# Altium schematic sheet Sber_Stroboscope_v1_01_001.SchDoc
size 594 x 420 mm; Date: 08.02.2024; CheckedBy: Васильев Д.С.; Author: Васильев Д.С.; CompanyName: SBER; DrawnBy: Васильев Д.С.; SheetNumber: 1; SheetTotal: 2
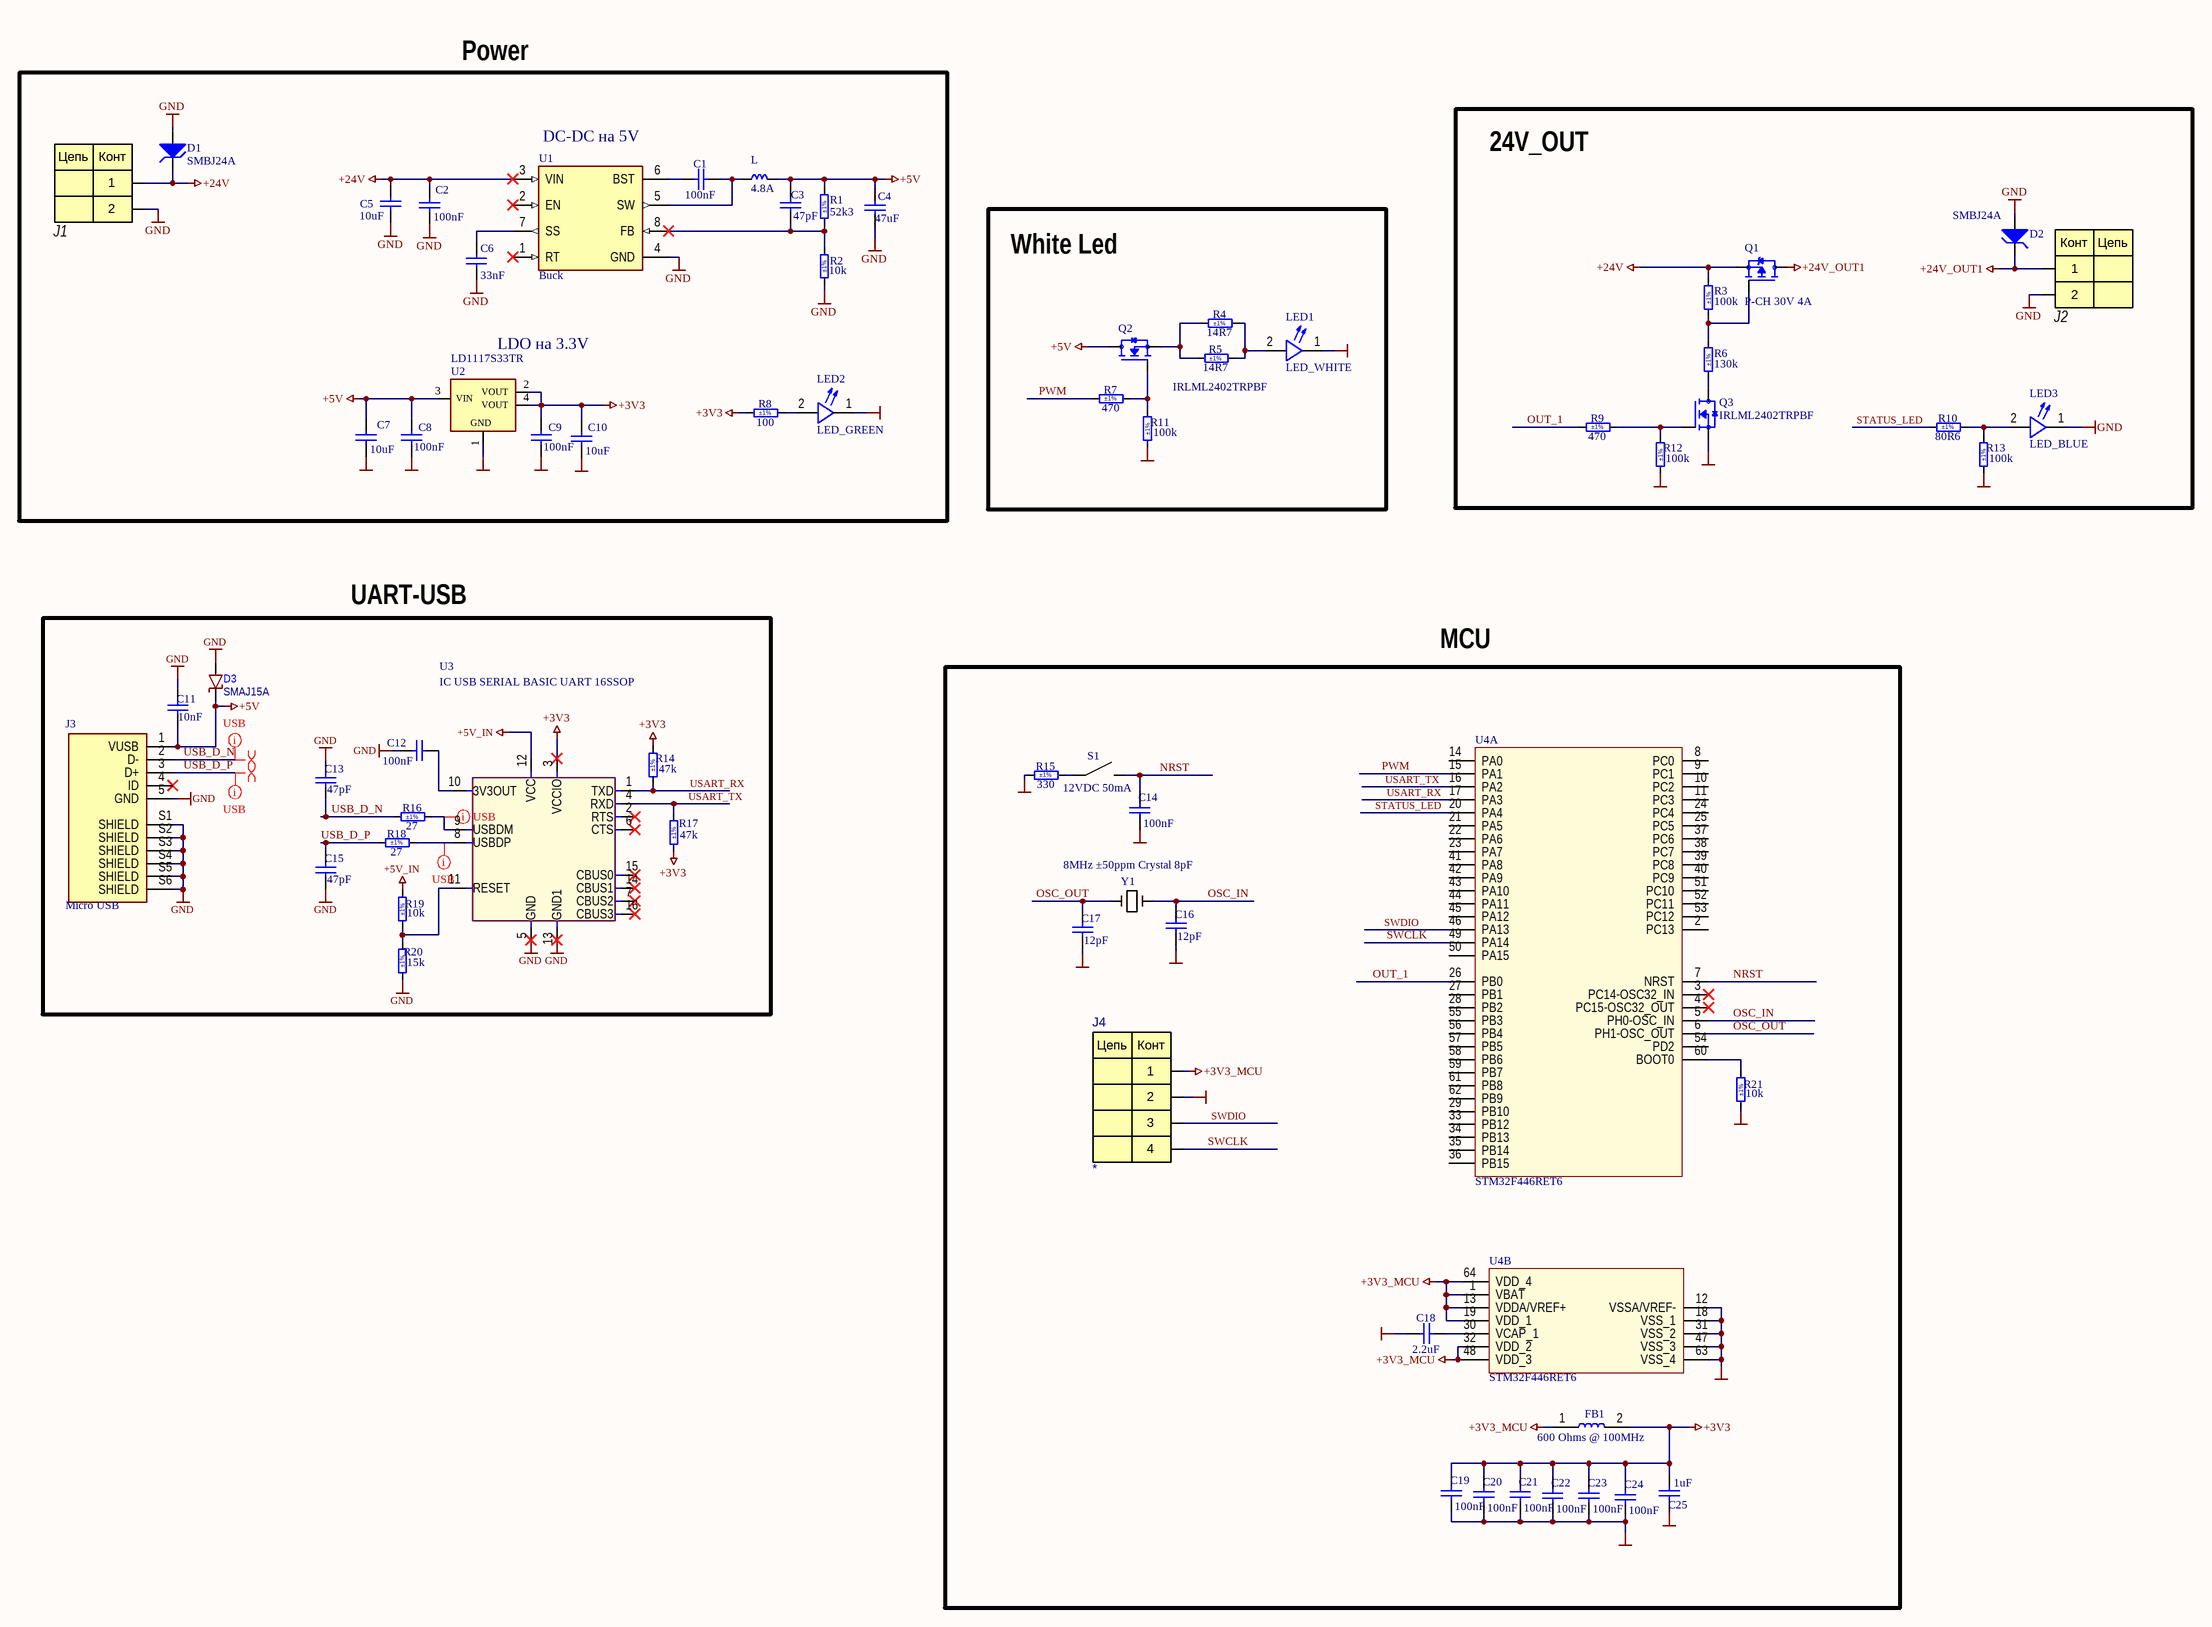
[diagram p0: Sber_Stroboscope_v1_01_001.SchDoc]

## Parts
C1  100nF  [CAPC1608X87N]
C2  100nF  [CAPC1608X87N]
C3  47pF  [CAPC1608X87N]
C4  47uF  [CAPC2012X145N]
C5  10uF  [CAPC2012X145N]
C6  33nF  [CAPC1608X87N]
C7  10uF  [CAPC2012X95N]
C8  100nF  [CAPC1608X87N]
C9  100nF  [CAPC1608X87N]
C10  10uF  [CAPC2012X95N]
C11  10nF  [CAPC1608X87N]
C12  100nF  [CAPC1608X87N]
C13  47pF  [CAPC1608X87N]
C14  100nF  [CAPC1608X87N]
C15  47pF  [CAPC1608X87N]
C16  12pF  [CAPC1608X87N]
C17  12pF  [CAPC1608X87N]
C18  2.2uF  [CAPC1608X87N]
C19  100nF  [CAPC1608X87N]
C20  100nF  [CAPC1608X87N]
C21  100nF  [CAPC1608X87N]
C22  100nF  [CAPC1608X87N]
C23  100nF  [CAPC1608X87N]
C24  100nF  [CAPC1608X87N]
C25  1uF  [CAPC1608X87N]
D1  SMBJ24A  [SMBJ24A]
D2  SMBJ24A  [SMBJ24A]
D3  SMAJ15A  [SZESD7371HT1G]
FB1  600 Ohms @ 100MHz  [Ferite Bead 0603]
J1  (no value)  [B2B-XH-A]
J2  (no value)  [B2B-XH-A]
J3  Micro USB  [Micro USB 10118192-0001LF - duplicate]
J4  *  [PLD-4_]
L  4.8A  [CLF10040T-6R8N-D]
LED1  LED_WHITE  [LTPL-A138DWAGB]
LED2  LED_GREEN  [LED_0805_GREEN]
LED3  LED_BLUE  [LED_0805_BLUE]
Q1  P-CH 30V 4A  [AO3401A]
Q2  IRLML2402TRPBF  [SOT23_3pins]
Q3  IRLML2402TRPBF  [SOT23_3pins]
R1  52k3  Tolerance: ±1%  [RESC1608X55N]
R2  10k  Tolerance: ±1%  [RESC1608X55N]
R3  100k  Tolerance: ±1%  [RESC1608X55N]
R4  14R7  Tolerance: ±1%  [RESC3016X65N]
R5  14R7  Tolerance: ±1%  [RESC3016X65N]
R6  130k  Tolerance: ±1%  [RESC1005X40N]
R7  470  Tolerance: ±1%  [RESC1608X55N]
R8  100  Tolerance: ±1%  [RESC1608X55N]
R9  470  Tolerance: ±1%  [RESC1608X55N]
R10  80R6  Tolerance: ±1%  [RESC1608X55N]
R11  100k  Tolerance: ±1%  [RESC1608X55N]
R12  100k  Tolerance: ±1%  [RESC1608X55N]
R13  100k  Tolerance: ±1%  [RESC1608X55N]
R14  47k  Tolerance: ±1%  [RESC1608X55N]
R15  330  Tolerance: ±1%  [RESC1608X55N]
R16  27  Tolerance: ±1%  [RESC1608X55N]
R17  47k  Tolerance: ±1%  [RESC1608X55N]
R18  27  Tolerance: ±1%  [RESC1608X55N]
R19  10k  Tolerance: ±1%  [RESC1608X55N]
R20  15k  Tolerance: ±1%  [RESC1608X55N]
R21  10k  Tolerance: ±1%  [RESC1608X55N]
S1  12VDC 50mA  [Pushbutton_2pins]
U1  Buck  [TPS62933DRLR]
U2  LD1117S33TR  [SOT-223_M]
U3  IC USB SERIAL BASIC UART 16SSOP  [FT230XS-R]
U4  STM32F446RET6  [STM32F446RET6]  (parts A,B of 2)
Y1  8MHz ±50ppm Crystal 8pF  [OSC_NX5032]

## Blocks framed on the sheet
24V_OUT: D2 J2 LED3 Q1 Q3 R3 R6 R9 R10 R12 R13
White Led: LED1 Q2 R4 R5 R7 R11

## Nets
+3V3: C9.1 C10.1 C19.1 C20.1 C21.1 C22.1 C23.1 C24.1 C25.2 FB1.2 R8.1 R14.1 R17.2 U2.2(VOUT) U2.4(VOUT) U3.3(VCCIO)
+3V3_MCU: FB1.1 J4.1 U4.1(VBAT) U4.13(VDDA/VREF+) U4.19(VDD_1) U4.32(VDD_2) U4.48(VDD_3) U4.64(VDD_4)
+5V: C3.1 C4.2 C7.1 C8.1 C11.1 D3.2(K) J3.1(VUSB) L.2 Q2.3(D) R1.1 U2.3(VIN)
+5V_IN: R19.1 U3.12(VCC)
+24V: C2.1 C5.2 D1.1 J1.1 Q1.2(S) R3.1 U1.3(VIN)
+24V_OUT1: D2.1 J2.1 Q1.3(D)
GND: C2.2 C4.1 C5.1 C6.2 C7.2 C8.2 C9.2 C10.2 C11.2 C12.2 C13.2 C14.2 C15.1 C16.2 C17.2 C18.1 C19.2 C20.2 C21.2 C22.2 C23.2 C24.2 C25.1 D1.2 D2.2 D3.1(A) J1.2 J2.2 J3.5(GND) J3.S1(SHIELD) J3.S2(SHIELD) J3.S3(SHIELD) J3.S4(SHIELD) J3.S5(SHIELD) J3.S6(SHIELD) J4.2 LED1.1 LED2.1 LED3.1 Q3.2(S) R2.2 R11.2 R12.2 R13.2 R15.1 R20.2 R21.2 U1.4(GND) U2.1(GND) U3.5(GND) U3.13(GND1) U4.12(VSSA/VREF-) U4.18(VSS_1) U4.31(VSS_2) U4.47(VSS_3) U4.63(VSS_4)
NRST: C14.1 S1.2 U4.7(NRST)
OSC_IN: C16.1 U4.5(PH0-OSC_IN) Y1.1
OSC_OUT: C17.1 U4.6(PH1-OSC_OUT) Y1.2
OUT_1: R9.1 U4.26(PB0)
PWM: R7.1 U4.15(PA1)
STATUS_LED: R10.1 U4.20(PA4)
SWCLK: J4.4 U4.49(PA14)
SWDIO: J4.3 U4.46(PA13)
USART_RX: R14.2 U3.1(TXD) U4.17(PA3)
USART_TX: R17.1 U3.4(RXD) U4.16(PA2)
USB_D_N: C13.1 J3.2(D-) R16.1
USB_D_P: C15.2 J3.3(D+) R18.1
NetC1_1: C1.1 U1.6(BST)
NetC1_2: C1.2 L.1 U1.5(SW)
NetC3_2: C3.2 R1.2 R2.1 U1.8(FB)
NetC6_1: C6.1 U1.7(SS)
NetC12_1: C12.1 U3.10(3V3OUT)
NetC18_2: C18.2 U4.30(VCAP_1)
NetLED1_2: LED1.2(VCC) R4.2 R5.2
NetLED2_2: LED2.2(VCC) R8.2
NetLED3_2: LED3.2(VCC) R10.2 R13.1
NetQ1_1: Q1.1(G) R3.2 R6.1
NetQ2_1: Q2.1(G) R7.2 R11.1
NetQ2_2: Q2.2(S) R4.1 R5.1
NetQ3_1: Q3.1(G) R9.2 R12.1
NetQ3_3: Q3.3(D) R6.2
NetR15_2: R15.2 S1.1
NetR16_2: R16.2 U3.9(USBDM)
NetR18_2: R18.2 U3.8(USBDP)
NetR19_2: R19.2 R20.1 U3.11(RESET)
NetR21_1: R21.1 U4.60(BOOT0)

Not connected (* = marked no-connect by the designer): J3 4(ID)*; U1 1(RT)* 2(EN)*; U3 2(RTS)* 6(CTS)* 7(CBUS2)* 14(CBUS1)* 15(CBUS0)* 16(CBUS3)*; U4 2(PC13) 3(PC14-OSC32_IN)* 4(PC15-OSC32_OUT)* 8(PC0) 9(PC1) 10(PC2) 11(PC3) 14(PA0) 21(PA5) 22(PA6) 23(PA7) 24(PC4) 25(PC5) 27(PB1) 28(PB2) 29(PB10) 33(PB12) 34(PB13) 35(PB14) 36(PB15) 37(PC6) 38(PC7) 39(PC8) 40(PC9) 41(PA8) 42(PA9) 43(PA10) 44(PA11) 45(PA12) 50(PA15) 51(PC10) 52(PC11) 53(PC12) 54(PD2) 55(PB3) 56(PB4) 57(PB5) 58(PB6) 59(PB7) 61(PB8) 62(PB9)

## Layout directives
differential pair; differential pair class USB: USB_D_N, USB_D_P
net class USB: NetR16_2, NetR18_2, USB_D_N, USB_D_P

## Notes on the sheet
- Power
- (near U1) DC-DC на 5V
- (near U2) LDO на 3.3V
- UART-USB
- MCU
- Перв. примен.
- Справ. №
- Подп. и дата
- Инв. № дубл.
- Взам. инв. №
- Разраб.
- Изм.
- Лист
- № докум.
- Подп.
- Дата
- Лит.
- Масса
- Масштаб
- Пров.
- Т.контр.
- Листов
- Инв. № подл.
- Утв.
- Н.контр.
- Копировал
- Формат А2
- (in symbol JST_CONN_Header_VERT_2.5mm) Цепь; Конт
- (in symbol PLD-4) Цепь; Конт

## Library data of the parts
C1 C12 C14 C19-C24 = CC0603_100NF_50V_10%_X7R: Non-polarised capacitor; Part Description: SMD Multilayer Chip Ceramic Capacitor; Manufacturer: GENERIC; Manufacturer1 Part Number: 223858615649; Voltage: 50V; TC: X7R; Tolerance: ±10%; Part Number: CC0603_100NF_50V_10%_X7R; Component Kind: Standard; Component Type: Standard; Pin Count: 2; Value: 100nF; Status: Preferred; Manufacturer Part Number: CC0603_100NF_50V_10%_X7R; Case: 0603; Mounted: Yes; Socket: No; SMD: Yes; Sense: No; Manufacturer1 Example: PHYCOMP; Manufacturer1 ComponentHeight: 0.87mm; HelpURL: \\cern.ch\dfs\Applications\Altium\Datasheets\CC0603_X7R_PHYCOMP.pdf; Author: CERN DEM JLC; CreateDate: 03.12.2007; LatestRevisionDate: 03.12.2007
C2 C8 C9 = CC0603_100NF_50V_10%_X5R: Non-polarised capacitor; Part Description: SMD Multilayer Chip Ceramic Capacitor; Manufacturer: GENERIC; Manufacturer1 Part Number: C1608X5R1H104K080; Voltage: 50V; TC: X5R; Tolerance: ±10%; Part Number: CC0603_100NF_50V_10%_X5R; Component Kind: Standard; Component Type: Standard; Pin Count: 2; Value: 100nF; Status: None; Manufacturer Part Number: CC0603_100NF_50V_10%_X5R; Case: 0603; Mounted: Yes; Socket: No; SMD: Yes; Sense: No; Manufacturer1 Example: TDK; Manufacturer1 ComponentHeight: 0.9mm; HelpURL: \\cern.ch\dfs\Applications\Altium\Datasheets\CC0603_X5R_TDK_C.pdf; Author: CERN DEM MR; CreateDate: 08.01.2016; LatestRevisionDate: 08.01.2016
C3 C13 C15 = CC0603_47PF_50V_5%_NP0: Non-polarised capacitor; Part Description: SMD Multilayer Chip Ceramic Capacitor; Manufacturer: GENERIC; Manufacturer1 Part Number: 223886715479; Voltage: 50V; TC: C0G/NP0; Tolerance: ±5%; Part Number: CC0603_47PF_50V_5%_NP0; Component Kind: Standard; Component Type: Standard; Pin Count: 2; Value: 47pF; Status: Preferred; Manufacturer Part Number: CC0603_47PF_50V_5%_NP0; Case: 0603; Mounted: Yes; Socket: No; SMD: Yes; Sense: No; Manufacturer1 Example: PHYCOMP; Manufacturer1 ComponentHeight: 0.87mm; HelpURL: \\cern.ch\dfs\Applications\Altium\Datasheets\CC0603_NP0_PHYCOMP.pdf; Author: CERN DEM JLC; CreateDate: 03.12.2007; LatestRevisionDate: 03.12.2007
C4 = CC0805_47UF_10V_20%_X5R: Non-polarised capacitor; Part Description: SMD Multilayer Chip Ceramic Capacitor; Manufacturer: GENERIC; Manufacturer1 Part Number: GRM21BR61A476ME15; Voltage: 10V; TC: X5R; Tolerance: ±20%; Part Number: CC0805_47UF_10V_20%_X5R; Component Kind: Standard; Component Type: Standard; Pin Count: 2; Value: 47uF; Status: Preferred; Manufacturer Part Number: CC0805_47UF_10V_20%_X5R; Case: 0805; Mounted: Yes; Socket: No; SMD: Yes; Sense: No; Manufacturer1 Example: MURATA; Manufacturer1 ComponentHeight: 1.45mm; HelpURL: \\cern.ch\dfs\Applications\Altium\Datasheets\CC0805_MURATA_GRM21BR61A476ME15.pdf; Author: CERN DEM BC; CreateDate: 08.09.2020; LatestRevisionDate: 08.09.2020
C5 = CC0805_10UF_35V_10%_X5R_MURATA_GRM21BR6YA106KE43L: Non-polarised capacitor; Part Description: Chip Multilayer Ceramic Capacitor for General Purpose; Manufacturer: MURATA; Voltage: 35V; TC: X5R; Tolerance: ±10%; Part Number: CC0805_10UF_35V_10%_X5R_MURATA_GRM21BR6YA106KE43L; Component Kind: Standard; Component Type: Standard; Pin Count: 2; Value: 10uF; Status: Not Recommended; Manufacturer Part Number: GRM21BR6YA106KE43; Case: 0805; Mounted: Yes; Socket: No; SMD: Yes; Sense: No; ComponentHeight: 1.45mm; HelpURL: \\cern.ch\dfs\Applications\Altium\Datasheets\CC0805_MURATA_GRM21BR6YA106KE43L.pdf; Author: CERN DEM BC; CreateDate: 24.03.2020; LatestRevisionDate: 24.03.2020
C6 = CC0603_33NF_25V_10%_X7R: Non-polarised capacitor; Part Description: SMD Multilayer Chip Ceramic Capacitor; Manufacturer: GENERIC; Manufacturer1 Part Number: 223891615643; Voltage: 25V; TC: X7R; Tolerance: ±10%; Part Number: CC0603_33NF_25V_10%_X7R; Component Kind: Standard; Component Type: Standard; Pin Count: 2; Value: 33nF; Status: Preferred; Manufacturer Part Number: CC0603_33NF_25V_10%_X7R; Case: 0603; Mounted: Yes; Socket: No; SMD: Yes; Sense: No; Manufacturer1 Example: PHYCOMP; Manufacturer1 ComponentHeight: 0.87mm; HelpURL: \\cern.ch\dfs\Applications\Altium\Datasheets\CC0603_X7R_PHYCOMP.pdf; Author: CERN DEM JLC; CreateDate: 03.12.2007; LatestRevisionDate: 03.12.2007
C7 C10 = CC0805_10UF_25V_10%_X5R: Non-polarised capacitor; Part Description: SMD Multilayer Chip Ceramic Capacitor; Manufacturer: GENERIC; Manufacturer1 Part Number: GRM219R61E106KA12D; Voltage: 25V; TC: X5R; Tolerance: ±10%; Part Number: CC0805_10UF_25V_10%_X5R; Component Kind: Standard; Component Type: Standard; Pin Count: 2; Value: 10uF; Status: Preferred; Manufacturer Part Number: CC0805_10UF_25V_10%_X5R; Case: 0805; Mounted: Yes; Socket: No; SMD: Yes; Sense: No; Manufacturer1 Example: MURATA; Manufacturer1 ComponentHeight: 0.95mm; HelpURL: \\cern.ch\dfs\Applications\Altium\Datasheets\CC0805_X5R_MURATA_GRM.pdf; Author: CERN DEM JLC; CreateDate: 25.10.2012; LatestRevisionDate: 06.09.2016
C11 = CC0603_10NF_50V_5%_C0G: Non-polarised capacitor; Part Description: SMD Multilayer Chip Ceramic Capacitor; Manufacturer: GENERIC; Manufacturer1 Part Number: C1608C0G1H103J080; Voltage: 50V; TC: C0G/NP0; Tolerance: ±5%; Part Number: CC0603_10NF_50V_5%_C0G; Component Kind: Standard; Component Type: Standard; Pin Count: 2; Value: 10nF; Status: Preferred; Manufacturer Part Number: CC0603_10NF_50V_5%_C0G; Case: 0603; Mounted: Yes; Socket: No; SMD: Yes; Sense: No; Manufacturer1 Example: TDK; Manufacturer1 ComponentHeight: 0.9mm; HelpURL: \\cern.ch\dfs\Applications\Altium\Datasheets\CC0603_C0G_TDK_C.pdf; Author: CERN DEM JLC; CreateDate: 10.12.2014; LatestRevisionDate: 10.12.2014
C16 C17 = CC0603_12PF_50V_5%_NP0: Non-polarised capacitor; Part Description: SMD Multilayer Chip Ceramic Capacitor; Manufacturer: GENERIC; Manufacturer1 Part Number: 223886715129; Voltage: 50V; TC: C0G/NP0; Tolerance: ±5%; Part Number: CC0603_12PF_50V_5%_NP0; Component Kind: Standard; Component Type: Standard; Pin Count: 2; Value: 12pF; Status: Preferred; Manufacturer Part Number: CC0603_12PF_50V_5%_NP0; Case: 0603; Mounted: Yes; Socket: No; SMD: Yes; Sense: No; Manufacturer1 Example: PHYCOMP; Manufacturer1 ComponentHeight: 0.87mm; HelpURL: \\cern.ch\dfs\Applications\Altium\Datasheets\CC0603_NP0_PHYCOMP.pdf; Author: CERN DEM JLC; CreateDate: 03.12.2007; LatestRevisionDate: 03.12.2007
C18 = CC0603_2.2UF_16V_10%_X5R: Non-polarised capacitor; Part Description: SMD Multilayer Chip Ceramic Capacitor; Manufacturer: GENERIC; Manufacturer1 Part Number: CC0603KRX5R7BB225; Voltage: 16V; TC: X5R; Tolerance: ±10%; Part Number: CC0603_2.2UF_16V_10%_X5R; Component Kind: Standard; Component Type: Standard; Pin Count: 2; Value: 2.2uF; Status: Preferred; Manufacturer Part Number: CC0603_2.2UF_16V_10%_X5R; Case: 0603; Mounted: Yes; Socket: No; SMD: Yes; Sense: No; Manufacturer1 Example: YAGEO PHYCOMP; Manufacturer1 ComponentHeight: 0.9mm; HelpURL: \\cern.ch\dfs\Applications\Altium\Datasheets\CC0805_X5R_PHYCOMP_HC.pdf; Author: CERN DEM JLC; CreateDate: 28.04.2011; LatestRevisionDate: 28.04.2011
C25 = CC0603_1UF_50V_10%_X5R: Non-polarised capacitor; Part Description: SMD Multilayer Chip Ceramic Capacitor; Manufacturer: GENERIC; Manufacturer1 Part Number: C1608X5R1H105K080; Voltage: 50V; TC: X5R; Tolerance: ±10%; Part Number: CC0603_1UF_50V_10%_X5R; Component Kind: Standard; Component Type: Standard; Pin Count: 2; Value: 1uF; Status: None; Manufacturer Part Number: CC0603_1UF_50V_10%_X5R; Case: 0603; Mounted: Yes; Socket: No; SMD: Yes; Sense: No; Manufacturer1 Example: TDK; Manufacturer1 ComponentHeight: 0.9mm; HelpURL: \\cern.ch\dfs\Applications\Altium\Datasheets\CC0603_X5R_TDK_C.pdf; Author: CERN DEM JMW; CreateDate: 09.11.2015; LatestRevisionDate: 09.11.2015
D1 D2 = DIODE_TVS_24V_SMBJ24A: ESD Suppressors / TVS Diodes 24volts 5uA 15.4 Amps Uni-Dir; Manufacturer: Bourns Inc.; Polarity: Unidirectional; Number of Channels:: 1 Channel; Working Voltage:: 24 V; Clamping Voltage:: 38.9 V; Breakdown Voltage:: 26.7 V; Ipp - Peak Pulse Current: 15.5 A; Pppm - Peak Pulse Power Dissipation:: 600 W; Series:: SMBJ; ComponentLink2Description: Datasheet; ComponentLink3Description: Package Specification; Part Number: SMBJ24A; Termination Style:: SMD/SMT; Package: DO-214AA-2; Product Type: TVS Diodes; Minimum Operating Temperature:: - 55 C; Maximum Operating Temperature:: + 150 C
D3 = DIODE_TVS_7V_SZESD7371HT1G: TVS DIODE 5.3VWM SOD323; Manufacturer: onsemi; Type: Zener; Unidirectional Channels: 1; Voltage - Reverse Standoff (Typ): 5.3V (Max); Voltage - Breakdown (Min): 7V; Current - Peak Pulse (10/1000µs): 16.4A; Power Line Protection: No; Capacitance @ Frequency: 0.43pF @ 1MHz; Part Number: SZESD7371HT1G; Voltage - Clamping (Max) @ Ipp: -; Power - Peak Pulse: -; Applications: Automotive, RF Antenna; Operating Temperature: -55°C ~ 150°C (TJ); Mounting Type: Surface Mount; Package: SOD-323
FB1 = MPZ1608S601ATA00: 600 Ohms @ 100MHz 1 Power Line Ferrite Bead 0603 _1608 Metric_ 1A 150mOhm; Manufacturer: TDK Corporation; ComponentLink2Description: Elitan; ComponentLink2URL: https://www.elitan.ru/price/item600575; Part Number: MPZ1608S601ATA00; Filter Type: Power Line; Current Rating: 1A; DC Resistance: 150mOhm; Operating Temperature: -55°C ~ 125°C; Package: 0603; Mounting Type: Surface Mount; Impedance @ Frequency: 600 Ohms @ 100MHz
J1 J2 = JST_CONN_Header_VERT_2.5mm: CONN HEADER VERT 2POS 2.5MM; Manufacturer: JST Sales America Inc.; Current Rating: 3A; Number of Positions: 2; Pitch - Mating: 2.50mm; Shrouding: Shrouded-4 Wall; Voltage Rating: 250V; Part Number: B2B-XH-A; Connector Type: Header; Contact Material: Brass; Contact Type: Male Pin; Fastening Type: Detent Lock; Mounting Type: Through Hole; Number of Rows: 1; Operating Temperature: -25В C ~ 85В C; Series: XH
J3 = Micro USB 10118194-0001LF_1: CONN RCPT USB2.0 MICRO B SMD R/A; Manufacturer: Amphenol ICC (FCI); Connector Type: USB - micro B; Number of Contacts: 5; Gender: Receptacle; Number of Ports: 1; Current Rating (Amps): 1.8A per Contact; Voltage - Rated: 100VAC; Mating Cycles: 10000; Shielding: Shielded; Part Number: 10118194-0001LF; Specifications: USB 2.0; Mounting Type: Surface Mount, Right Angle; Through Hole; Mounting Feature: Flange, Horizontal; Termination: Solder; Features: Solder Retention; Ingress Protection: -; Operating Temperature: -30°C ~ 80°C; Contact Finish: Gold; Shell/Shielding Material: Steel, Stainless
J4 = PLD-4: Manufacturer: China; Check: False; Annotation: *; Param: *; Value: *; Part Number: PLD-4; Place: *; Temperature: -40°C~105°C
L = IND_6.8UH_20%_4.8A_TDK: Power Inductors - SMD 6.8uH 18.5mOhms 4.8A AEC-Q200 (150C); Manufacturer: TDK; Shielding: Shielded; Tolerance: 30 %; Maximum DC Current: 3.7 A; Core Type: Wirewound; Part Number: CLF10040T-6R8N-D; Termination Style: SMD/SMT; Package: 10 mm x 9.7 mm; Inductance: 6.8 uH; Maximum DC Resistance: 18.5 mOhms; Saturation Current: 4.8 A; Minimum Operating Temperature: - 40 C; Maximum Operating Temperature: + 105 C; Mounting Style: PCB Mount
LED1 = LED_0505_White: LED Lighting - White, Neutral 4500K (4000K ~ 5000K) 3.2V 1A 120° 0505 (1313 Metric); Manufacturer: Lite-On Inc.; Flux @ 25°C, Current - Test: 240lm (Typ); Lumens/Watt @ Current - Test: 75 lm/W; CRI (Color Rendering Index): 80; Current - Max: 350mA; Thermal Resistance of Package: 9.5°C/W; Part Number: LTPL-A138DWAGB; Colour: White, Neutral; CCT (K): 4500K (4000K ~ 5000K); Current - Test: 1A; Voltage - Forward (Vf) (Typ): 3.2V; Viewing Angle: 120°; Mounting Type: Surface Mount; Package: 0505
LED2 = LED_0805_GREEN_2: Green 525nm LED Indication - Discrete 3.2V 0805 (2012 Metric); Part Number: SZYY0805G; Manufacturer: otoelectric SZYY0805G; Wave Length: 518 nm; Peak Forard Current: 100mA; Power Dissipation: 120mW; Continious Forward Current: 20mA; Voltage Forward: 2.9; Colour: Green; Operating Temperature: -20C to +80C; Mounting Type: Surface Mount; Package: 0805; ComponentLink1Description: Chip-Dip; ComponentLink1URL: https://www.chipdip.ru/product/to-2013bc-pg
LED3 = LED_0805_BLUE_1: LED_0805_BLUE SMD 247mKd 468нМ; Part Number: SZYY0805B; Manufacturer: Yongyu Photoelectric; Colour: Blue; Wave Length: 468 nm; Peak Forard Current: 80mA; Power Dissipation: 105mW; Continious Forward Current: 30mA; Voltage Forward: 2.9; Operating Temperature: -55C to +85C; Mounting Type: Surface Mount; Package: 0805; ComponentLink1Description: Chip-Dip; ComponentLink1URL: https://www.chipdip.ru/product/to-2013bc-bf
Q1 = Q_AO3401A: MOSFET P-CH 30V 4A SOT23-3L; Manufacturer: Alpha & Omega Semiconductor Inc.; FET Type: P-Channel; Current - Continuous Drain (Id) @ 25°C: 4A (Ta); Drive Voltage (Max Rds On, Min Rds On): 10V; Rds On (Max) @ Id, Vgs: 44mOhm @ 4.3A, 10V; Vgs(th) (Max) @ Id: 1.3V @ 250µA; Gate Charge (Qg) (Max) @ Vgs: 12.2 nC @ 4.5 V; Vgs (Max): ±12V; Input Capacitance (Ciss) (Max) @ Vds: 1200 pF @ 15 V; Power Dissipation (Max): 1.4W (Ta); Part Number: AO3401A; Technology: MOSFET (Metal Oxide); Drain to Source Voltage (Vdss): 30 V; Operating Temperature: -55°C ~ 150°C (TJ); Mounting Type: Surface Mount; Package: SOT-23-3
Q2 Q3 = Q_IRLML2402TRPBF: N-Channel 20V 1.2A (Ta) 540mW (Ta) Surface Mount Micro3™/SOT-23; Manufacturer: Infineon Technologies; Type: MOSFET N-CH 20V 1.2A SOT23; Drive Voltage (Max Rds On, Min Rds On): 2.7V, 4.5V; Rds On (Max) @ Id, Vgs: 250mOhm @ 930mA, 4.5V; Vgs(th) (Max) @ Id: 700mV @ 250µA; Vgs (Max): ±12V; Input Capacitance: 110pF @ 15V; ComponentLink1Description: DigiKey; ComponentLink1URL: https://www.digikey.com/product-detail/en/infineon-technologies/IRLML2402TRPBF/IRLML2402PBFCT-ND/812508; ComponentLink2Description: Elitan; ComponentLink2URL: https://www.elitan.ru/price/index.php?find=IRLML2402TRPBF&delay=-1&mfg=all&seenform=y; Part Number: IRLML2402TRPBF; FET Type: N-Channel; Current - Continuous Drain (Id) @ 25°C: 1.2A (Ta); Power Dissipation (Max): 540mW (Ta); Operating Temperature: -55°C ~ 150°C (TJ); Mounting Type: Surface Mount; Package: SOT-23-3; Drain to Source Voltage (Vdss): 20V
R1 = R0603_52K3_0.1%_0.063W_10PPM: Resistor - 0.1%; Part Number: R0603_52K3_1%_0.063W_10PPM; Part Description: Thin Film Chip Resistor; Manufacturer: GENERIC; Manufacturer1 Part Number: RN73C1J52K3BTDF; Power: 0.063W; TC: ±10ppm; PressFit: No; Component Kind: Standard; Component Type: Standard; Pin Count: 2; Value: 52k3; Status: Not Recommended; Manufacturer Part Number: R0603_52K3_1%_0.063W_10PPM; Case: 0603; Mounted: Yes; Sense: No; Socket: No; SMD: Yes; Manufacturer1 Example: TYCO HOLSWORTHY; Manufacturer1 ComponentHeight: 0.5mm; HelpURL: \\cern.ch\dfs\Applications\Altium\Datasheets\R0603_Tyco_RN73.pdf; Author: CERN DEM JLC; CreateDate: 03.12.2007; LatestRevisionDate: 13.03.2008
R2 R19 R21 = R0603_10K_1%_0.1W_100PPM: Resistor - 1%; Part Description: General Purpose Thick Film Chip Resistor; Manufacturer: GENERIC; Manufacturer1 Part Number: NRC06F1002TRF; Power: 0.1W; TC: ±100ppm/°C; PressFit: No; Part Number: R0603_10K_1%_0.1W_100PPM; Component Kind: Standard; Component Type: Standard; Pin Count: 2; Value: 10k; Status: Preferred; Manufacturer Part Number: R0603_10K_1%_0.1W_100PPM; Case: 0603; Mounted: Yes; Sense: No; Socket: No; SMD: Yes; Manufacturer1 Example: NIC COMPONENT; Manufacturer1 ComponentHeight: 0.55mm; HelpURL: \\cern.ch\dfs\Applications\Altium\Datasheets\R0603_NIC_NRC.pdf; Author: CERN DEM JLC; CreateDate: 03.12.2007; LatestRevisionDate: 13.03.2008
R3 R11-R13 = R0603_100K_1%_0.1W_100PPM: Resistor - 1%; Part Description: General Purpose Thick Film Chip Resistor; Manufacturer: GENERIC; Manufacturer1 Part Number: NRC06F1003TRF; Power: 0.1W; TC: ±100ppm/°C; PressFit: No; Part Number: R0603_100K_1%_0.1W_100PPM; Component Kind: Standard; Component Type: Standard; Pin Count: 2; Value: 100k; Status: Preferred; Manufacturer Part Number: R0603_100K_1%_0.1W_100PPM; Case: 0603; Mounted: Yes; Sense: No; Socket: No; SMD: Yes; Manufacturer1 Example: NIC COMPONENT; Manufacturer1 ComponentHeight: 0.55mm; HelpURL: \\cern.ch\dfs\Applications\Altium\Datasheets\R0603_NIC_NRC.pdf; Author: CERN DEM JLC; CreateDate: 03.12.2007; LatestRevisionDate: 13.03.2008
R4 R5 = R1206_14R7_0.1%_0.25W_15PPM: Resistor - 0.1%; Part Number: R1206_14R7_0.1%_0.66W_15PPM; Part Description: Thin Film Chip Resistor; Manufacturer: GENERIC; Manufacturer Part Number: R1206_14R7_1%_0.66W_15PPM; Manufacturer1 Part Number: RP73D2B14R7BTG; Power: 0.66W; TC: ±15ppm/°C; PressFit: No; Component Kind: Standard; Component Type: Standard; Pin Count: 2; Value: 14R7; Status: Not Recommended; Case: 1206; Mounted: Yes; Sense: No; Socket: No; SMD: Yes; Manufacturer1 Example: TYCO ELECTRONICS; Manufacturer1 ComponentHeight: 0.65mm; HelpURL: \\cern.ch\dfs\Applications\Altium\Datasheets\R1206_TYCO_RP73.pdf; Author: CERN DEM JMW; CreateDate: 01.06.2015; LatestRevisionDate: 01.06.2015
R6 = R0402_130K_1%_0.0625W_100PPM: Resistor - 1%; Part Description: General Purpose Thick Film Chip Resistor; Manufacturer: GENERIC; Manufacturer1 Part Number: 232270671304L; TC: ±100ppm/°C; PressFit: No; Part Number: R0402_130K_1%_0.0625W_100PPM; Component Kind: Standard; Component Type: Standard; Pin Count: 2; Value: 130k; Status: Not Recommended; Power: 0.0625W; Manufacturer Part Number: R0402_130K_1%_0.0625W_100PPM; Case: 0402; Mounted: Yes; Sense: No; Socket: No; SMD: Yes; Manufacturer1 Example: YAGEO PHYCOMP; Manufacturer1 ComponentHeight: 0.4mm; HelpURL: \\cern.ch\dfs\Applications\Altium\Datasheets\R0402_Phycomp_RC0402.pdf; Author: CERN DEM JLC; CreateDate: 03.12.2007; LatestRevisionDate: 17.10.2012
R7 R9 = R0603_470R_1%_0.1W_100PPM: Resistor - 1%; Part Description: General Purpose Thick Film Chip Resistor; Manufacturer: GENERIC; Manufacturer1 Part Number: NRC06F4700TRF; Power: 0.1W; TC: ±100ppm/°C; PressFit: No; Part Number: R0603_470R_1%_0.1W_100PPM; Component Kind: Standard; Component Type: Standard; Pin Count: 2; Value: 470; Status: Preferred; Manufacturer Part Number: R0603_470R_1%_0.1W_100PPM; Case: 0603; Mounted: Yes; Sense: No; Socket: No; SMD: Yes; Manufacturer1 Example: NIC COMPONENT; Manufacturer1 ComponentHeight: 0.55mm; HelpURL: \\cern.ch\dfs\Applications\Altium\Datasheets\R0603_NIC_NRC.pdf; Author: CERN DEM JLC; CreateDate: 03.12.2007; LatestRevisionDate: 13.03.2008
R8 = R0603_100R_1%_0.1W_100PPM: Resistor - 1%; Part Description: General Purpose Thick Film Chip Resistor; Manufacturer: GENERIC; Manufacturer1 Part Number: NRC06F4700TRF; Power: 0.1W; TC: ±100ppm/°C; PressFit: No; Part Number: R0603_100R_1%_0.1W_100PPM; Component Kind: Standard; Component Type: Standard; Pin Count: 2; Value: 100; Status: Preferred; Manufacturer Part Number: R0603_100R_1%_0.1W_100PPM; Case: 0603; Mounted: Yes; Sense: No; Socket: No; SMD: Yes; Manufacturer1 Example: NIC COMPONENT; Manufacturer1 ComponentHeight: 0.55mm; HelpURL: \\cern.ch\dfs\Applications\Altium\Datasheets\R0603_NIC_NRC.pdf; Author: CERN DEM JLC; CreateDate: 03.12.2007; LatestRevisionDate: 13.03.2008
R10 = R0603_80R6_0.1%_0.1W_15PPM: Resistor - 0.1%; Part Number: R0603_80R6_1%_0.1W_15PPM; Part Description: Thin Film Chip Resistor; Manufacturer: GENERIC; Manufacturer1 Part Number: RP73D1J80R6BTDG; Power: 0.1W; TC: ±15ppm; PressFit: No; Component Kind: Standard; Component Type: Standard; Pin Count: 2; Value: 80R6; Status: Not Recommended; Manufacturer Part Number: R0603_80R6_1%_0.1W_15PPM; Case: 0603; Mounted: Yes; Sense: No; Socket: No; SMD: Yes; Manufacturer1 Example: TYCO HOLSWORTHY; Manufacturer1 ComponentHeight: 0.5mm; HelpURL: \\cern.ch\dfs\Applications\Altium\Datasheets\R0603_TYCO_RP73.pdf; Author: CERN DEM JLC; CreateDate: 26.01.2010; LatestRevisionDate: 26.01.2010
R14 R17 = R0603_47K_1%_0.1W_100PPM: Resistor - 1%; Part Description: General Purpose Thick Film Chip Resistor; Manufacturer: GENERIC; Manufacturer1 Part Number: NRC06F4702TRF; Power: 0.1W; TC: ±100ppm/°C; PressFit: No; Part Number: R0603_47K_1%_0.1W_100PPM; Component Kind: Standard; Component Type: Standard; Pin Count: 2; Value: 47k; Status: Preferred; Manufacturer Part Number: R0603_47K_1%_0.1W_100PPM; Case: 0603; Mounted: Yes; Sense: No; Socket: No; SMD: Yes; Manufacturer1 Example: NIC COMPONENT; Manufacturer1 ComponentHeight: 0.55mm; HelpURL: \\cern.ch\dfs\Applications\Altium\Datasheets\R0603_NIC_NRC.pdf; Author: CERN DEM JLC; CreateDate: 03.12.2007; LatestRevisionDate: 13.03.2008
R15 = R0603_330R_1%_0.1W_100PPM: Resistor - 1%; Part Description: General Purpose Thick Film Chip Resistor; Manufacturer: GENERIC; Manufacturer1 Part Number: NRC06F3300TRF; Power: 0.1W; TC: ±100ppm/°C; PressFit: No; Part Number: R0603_330R_1%_0.1W_100PPM; Component Kind: Standard; Component Type: Standard; Pin Count: 2; Value: 330; Status: Preferred; Manufacturer Part Number: R0603_330R_1%_0.1W_100PPM; Case: 0603; Mounted: Yes; Sense: No; Socket: No; SMD: Yes; Manufacturer1 Example: NIC COMPONENT; Manufacturer1 ComponentHeight: 0.55mm; HelpURL: \\cern.ch\dfs\Applications\Altium\Datasheets\R0603_NIC_NRC.pdf; Author: CERN DEM JLC; CreateDate: 03.12.2007; LatestRevisionDate: 13.03.2008
R16 R18 = R0603_27R_1%_0.1W_100PPM: Resistor - 1%; Part Description: General Purpose Thick Film Chip Resistor; Manufacturer: GENERIC; Manufacturer1 Part Number: NRC06F27R0TRF; Power: 0.1W; TC: ±100ppm/°C; PressFit: No; Part Number: R0603_27R_1%_0.1W_100PPM; Component Kind: Standard; Component Type: Standard; Pin Count: 2; Value: 27; Status: Preferred; Manufacturer Part Number: R0603_27R_1%_0.1W_100PPM; Case: 0603; Mounted: Yes; Sense: No; Socket: No; SMD: Yes; Manufacturer1 Example: NIC COMPONENT; Manufacturer1 ComponentHeight: 0.55mm; HelpURL: \\cern.ch\dfs\Applications\Altium\Datasheets\R0603_NIC_NRC.pdf; Author: CERN DEM JLC; CreateDate: 03.12.2007; LatestRevisionDate: 13.03.2008
R20 = R0603_15K_1%_0.1W_100PPM: Resistor - 1%; Part Description: General Purpose Thick Film Chip Resistor; Manufacturer: GENERIC; Manufacturer1 Part Number: NRC06F1502TRF; Power: 0.1W; TC: ±100ppm/°C; PressFit: No; Part Number: R0603_15K_1%_0.1W_100PPM; Component Kind: Standard; Component Type: Standard; Pin Count: 2; Value: 15k; Status: Preferred; Manufacturer Part Number: R0603_15K_1%_0.1W_100PPM; Case: 0603; Mounted: Yes; Sense: No; Socket: No; SMD: Yes; Manufacturer1 Example: NIC COMPONENT; Manufacturer1 ComponentHeight: 0.55mm; HelpURL: \\cern.ch\dfs\Applications\Altium\Datasheets\R0603_NIC_NRC.pdf; Author: CERN DEM JMW; CreateDate: 17.08.2015; LatestRevisionDate: 17.08.2015
S1 = PushButton: Pushbutton, 2pins, 50mA 12VDC; Manufacturer: KLS electronic; Part Number: L-KLS7-TS3608-5.0-180; Power: 0.6W; Resistance: 50e-3; Pin Count: 2; Value: 12VDC 50mA; Mounted: Yes; Socket: No; SMD: Yes; ComponentLink1Description: CHip-dip; ComponentLink1URL: https://www.chipdip.ru/product/kls7-ts3608-5.0-180-td-02xa; ComponentLink2Description: ChipDip; ComponentLink2URL: https://www.chipdip.ru/product/kls7-ts3608-5.0-180-td-02xa
U1 = DC-DC_TPS62933DRLR: Switching Voltage Regulators 3.8-V to 30-V, 3-A, 200-kHz to 2.2-MHz, low-IQ synchronous buck converter in SOT-583 package 8-SOT-5X3 -40 to 150; Manufacturer: Texas Instruments; Output Voltage: 800 mV to 22 V; Output Current: 3 A; Input Voltage, Max: 30 V; Number of Outputs: 1 Output; Switching Frequency: 310 kHz to 2.1 MHz; Quiescent Current: 12 uA; Input Voltage, Min: 3.8 V; Part Number: TPS62933DRLR; Topology: Buck; Package: SOT-583-8; Mounting Style: SMD; Minimum Operating Temperature: - 40 C; Maximum Operating Temperature: + 150 C
U2 = LD1117S33TR: Fixed Low Drop Positive Voltage Regulator, 3.3V, 4-Pin SOT-223, Tape and Reel; ComponentLink1Description: Manufacturer URL; ComponentLink2Description: Datasheet; DatasheetVersion: 1/11/2011; ComponentLink1URL: http://www.st.com; PackageVersion: 2010; PackageDescription: 4-Pin SOT-223 Package, 6.5 x 3.5 mm Body, 2.3 mm Pitch, 7 mm Lead Span; ComponentLink2URL: http://www.st.com/internet/com/TECHNICAL_RESOURCES/TECHNICAL_LITERATURE/DATASHEET/CD00000544.pdf; PackageReference: SOT-223; PartNumber: LD1117S33TR
U3 = FT230XS-R: USB Bridge, USB to UART USB 2.0 UART Interface 16-SSOP; Manufacturer: FTDI, Future Technology Devices International Ltd; Standards: USB 2.0; Voltage - Supply: 3.3V ~ 5V; Current - Supply: 8mA; Part Number: FT230XS-R; Protocol: USB; Function: Bridge, USB to UART; Interface: UART; Operating Temperature: -40°C ~ 85°C; Package: 16-SSOP
U4 = STM32F446RET6: ARM® Cortex®-M4 STM32F4 Microcontroller IC 32-Bit Single-Core 180MHz 512KB (512K x 8) FLASH 64-LQFP (10x10); Manufacturer: STMicroelectronics; Connectivity: CANbus, EBI/EMI, I2C, IrDA, LINbus, SAI, SD, SPDIF-Rx, SPI, UART/USART, USB, USB OTG; Peripherals: Brown-out Detect/Reset, DMA, I2S, LVD, POR, PWM, WDT; Number of I/O: 50; RAM Size: 128K x 8; Voltage - Supply (Vcc/Vdd): 1.7V ~ 3.6V; Data Converters: A/D 16x12b; D/A 2x12b; Oscillator Type: Internal; Part Number: STM32F446RET6; Core Processor: ARM® Cortex®-M4; Core Size: 32-Bit Single-Core; Speed: 180MHz; Program Memory Size: 512KB (512K x 8); Program Memory Type: FLASH; Operating Temperature: -40°C ~ 85°C (TA); Mounting Type: Surface Mount; Package: 64-LQFP
Y1 = Crystal_NX5032GA-8.000M-STD-CSU-1: 8MHz ±50ppm Crystal 8pF 300 Ohms 2-SMD, No Lead; Manufacturer: NDK America, Inc.; Pin Count: 2; Mounting Type: Surface Mount; ComponentLink1Description: DigiKey; ComponentLink1URL: https://www.digikey.com/product-detail/en/ndk-america-inc/NX5032GA-8-000M-STD-CSU-1/644-1132-1-ND/1788487; Part Number: NX5032GA-8.000M-STD-CSU-1; TYPE: MHz Crystal; Frequency: 8MHz; Load Capacitance: 8pF; ESR: 300 Ohms; Operating Temperature: -40°C ~ 150°C; Package: 2-SMD